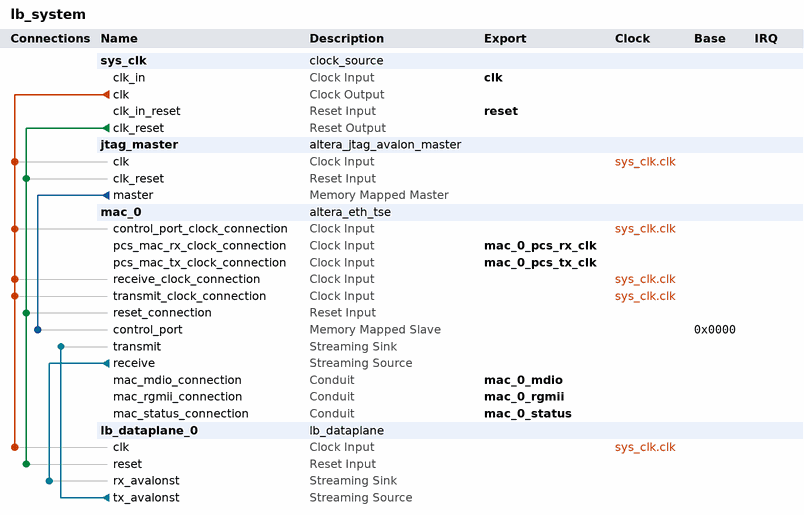
[diagram p0: system contents]
# Platform Designer (Qsys) system lb_system, Cyclone IV E EP4CE115F29C7
# Parameters at their usual value, and those the tool derives, are not listed.
package require -exact qsys 20.1
create_system lb_system
set_project_property DEVICE_FAMILY {Cyclone IV E}
set_project_property DEVICE EP4CE115F29C7

add_instance sys_clk clock_source 20.1
set_instance_parameter_value sys_clk clockFrequency 100000000

add_instance jtag_master altera_jtag_avalon_master 20.1

add_instance mac_0 altera_eth_tse 20.1
set_instance_parameter_value mac_0 XCVR_RCFG_JTAG_ENABLE 0
set_instance_parameter_value mac_0 XCVR_SET_CAPABILITY_REG_ENABLE 0
set_instance_parameter_value mac_0 XCVR_SET_CSR_SOFT_LOGIC_ENABLE 0
set_instance_parameter_value mac_0 XCVR_SET_PRBS_SOFT_LOGIC_ENABLE 0
set_instance_parameter_value mac_0 XCVR_SET_USER_IDENTIFIER 0
set_instance_parameter_value mac_0 core_variation MAC_ONLY
set_instance_parameter_value mac_0 enable_hd_logic false
set_instance_parameter_value mac_0 enable_mac_flow_ctrl false
set_instance_parameter_value mac_0 enable_magic_detect false
set_instance_parameter_value mac_0 enable_shift16 true
set_instance_parameter_value mac_0 ifGMII RGMII
set_instance_parameter_value mac_0 ing_addr 11
set_instance_parameter_value mac_0 max_channels 4
set_instance_parameter_value mac_0 mdio_clk_div 40
set_instance_parameter_value mac_0 stat_cnt_ena false
set_instance_parameter_value mac_0 transceiver_type NONE

add_instance lb_dataplane_0 lb_dataplane 1.0

# connections
add_connection sys_clk.clk jtag_master.clk clock
add_connection sys_clk.clk lb_dataplane_0.clk clock
add_connection sys_clk.clk mac_0.control_port_clock_connection clock
add_connection sys_clk.clk mac_0.receive_clock_connection clock
add_connection sys_clk.clk mac_0.transmit_clock_connection clock
add_connection sys_clk.clk_reset jtag_master.clk_reset reset
add_connection sys_clk.clk_reset lb_dataplane_0.reset reset
add_connection sys_clk.clk_reset mac_0.reset_connection reset
add_connection jtag_master.master mac_0.control_port avalon
set_connection_parameter_value jtag_master.master/mac_0.control_port baseAddress 0x0000
add_connection lb_dataplane_0.tx_avalonst mac_0.transmit avalon_streaming
add_connection mac_0.receive lb_dataplane_0.rx_avalonst avalon_streaming

# exported interfaces
add_interface clk clock sink
set_interface_property clk EXPORT_OF sys_clk.clk_in
add_interface mac_0_mdio conduit end
set_interface_property mac_0_mdio EXPORT_OF mac_0.mac_mdio_connection
add_interface mac_0_pcs_rx_clk clock sink
set_interface_property mac_0_pcs_rx_clk EXPORT_OF mac_0.pcs_mac_rx_clock_connection
add_interface mac_0_pcs_tx_clk clock sink
set_interface_property mac_0_pcs_tx_clk EXPORT_OF mac_0.pcs_mac_tx_clock_connection
add_interface mac_0_rgmii conduit end
set_interface_property mac_0_rgmii EXPORT_OF mac_0.mac_rgmii_connection
add_interface mac_0_status conduit end
set_interface_property mac_0_status EXPORT_OF mac_0.mac_status_connection
add_interface reset reset sink
set_interface_property reset EXPORT_OF sys_clk.clk_in_reset

set_interconnect_requirement {$system} qsys_mm.clockCrossingAdapter HANDSHAKE
set_interconnect_requirement {$system} qsys_mm.enableEccProtection FALSE
set_interconnect_requirement {$system} qsys_mm.insertDefaultSlave FALSE
set_interconnect_requirement {$system} qsys_mm.maxAdditionalLatency 1

save_system lb_system.qsys
